# EasyEDA Pro project EasyEDA_ProPrj_Magnetic_Pole_Detector.epro

# Schematic SCH_Magnetic_Pole_Detector
Board Name: Magnetic_Pole_Detector; Create Date: 2026-03-04; Page Name: P1; Project Name: Magnetic_Pole_Detector; Schematic Name: SCH_Magnetic_Pole_Detector; Update Date: 2026-04-22; Drawn: nikzin96; Page Size: A4; Version: V1.0
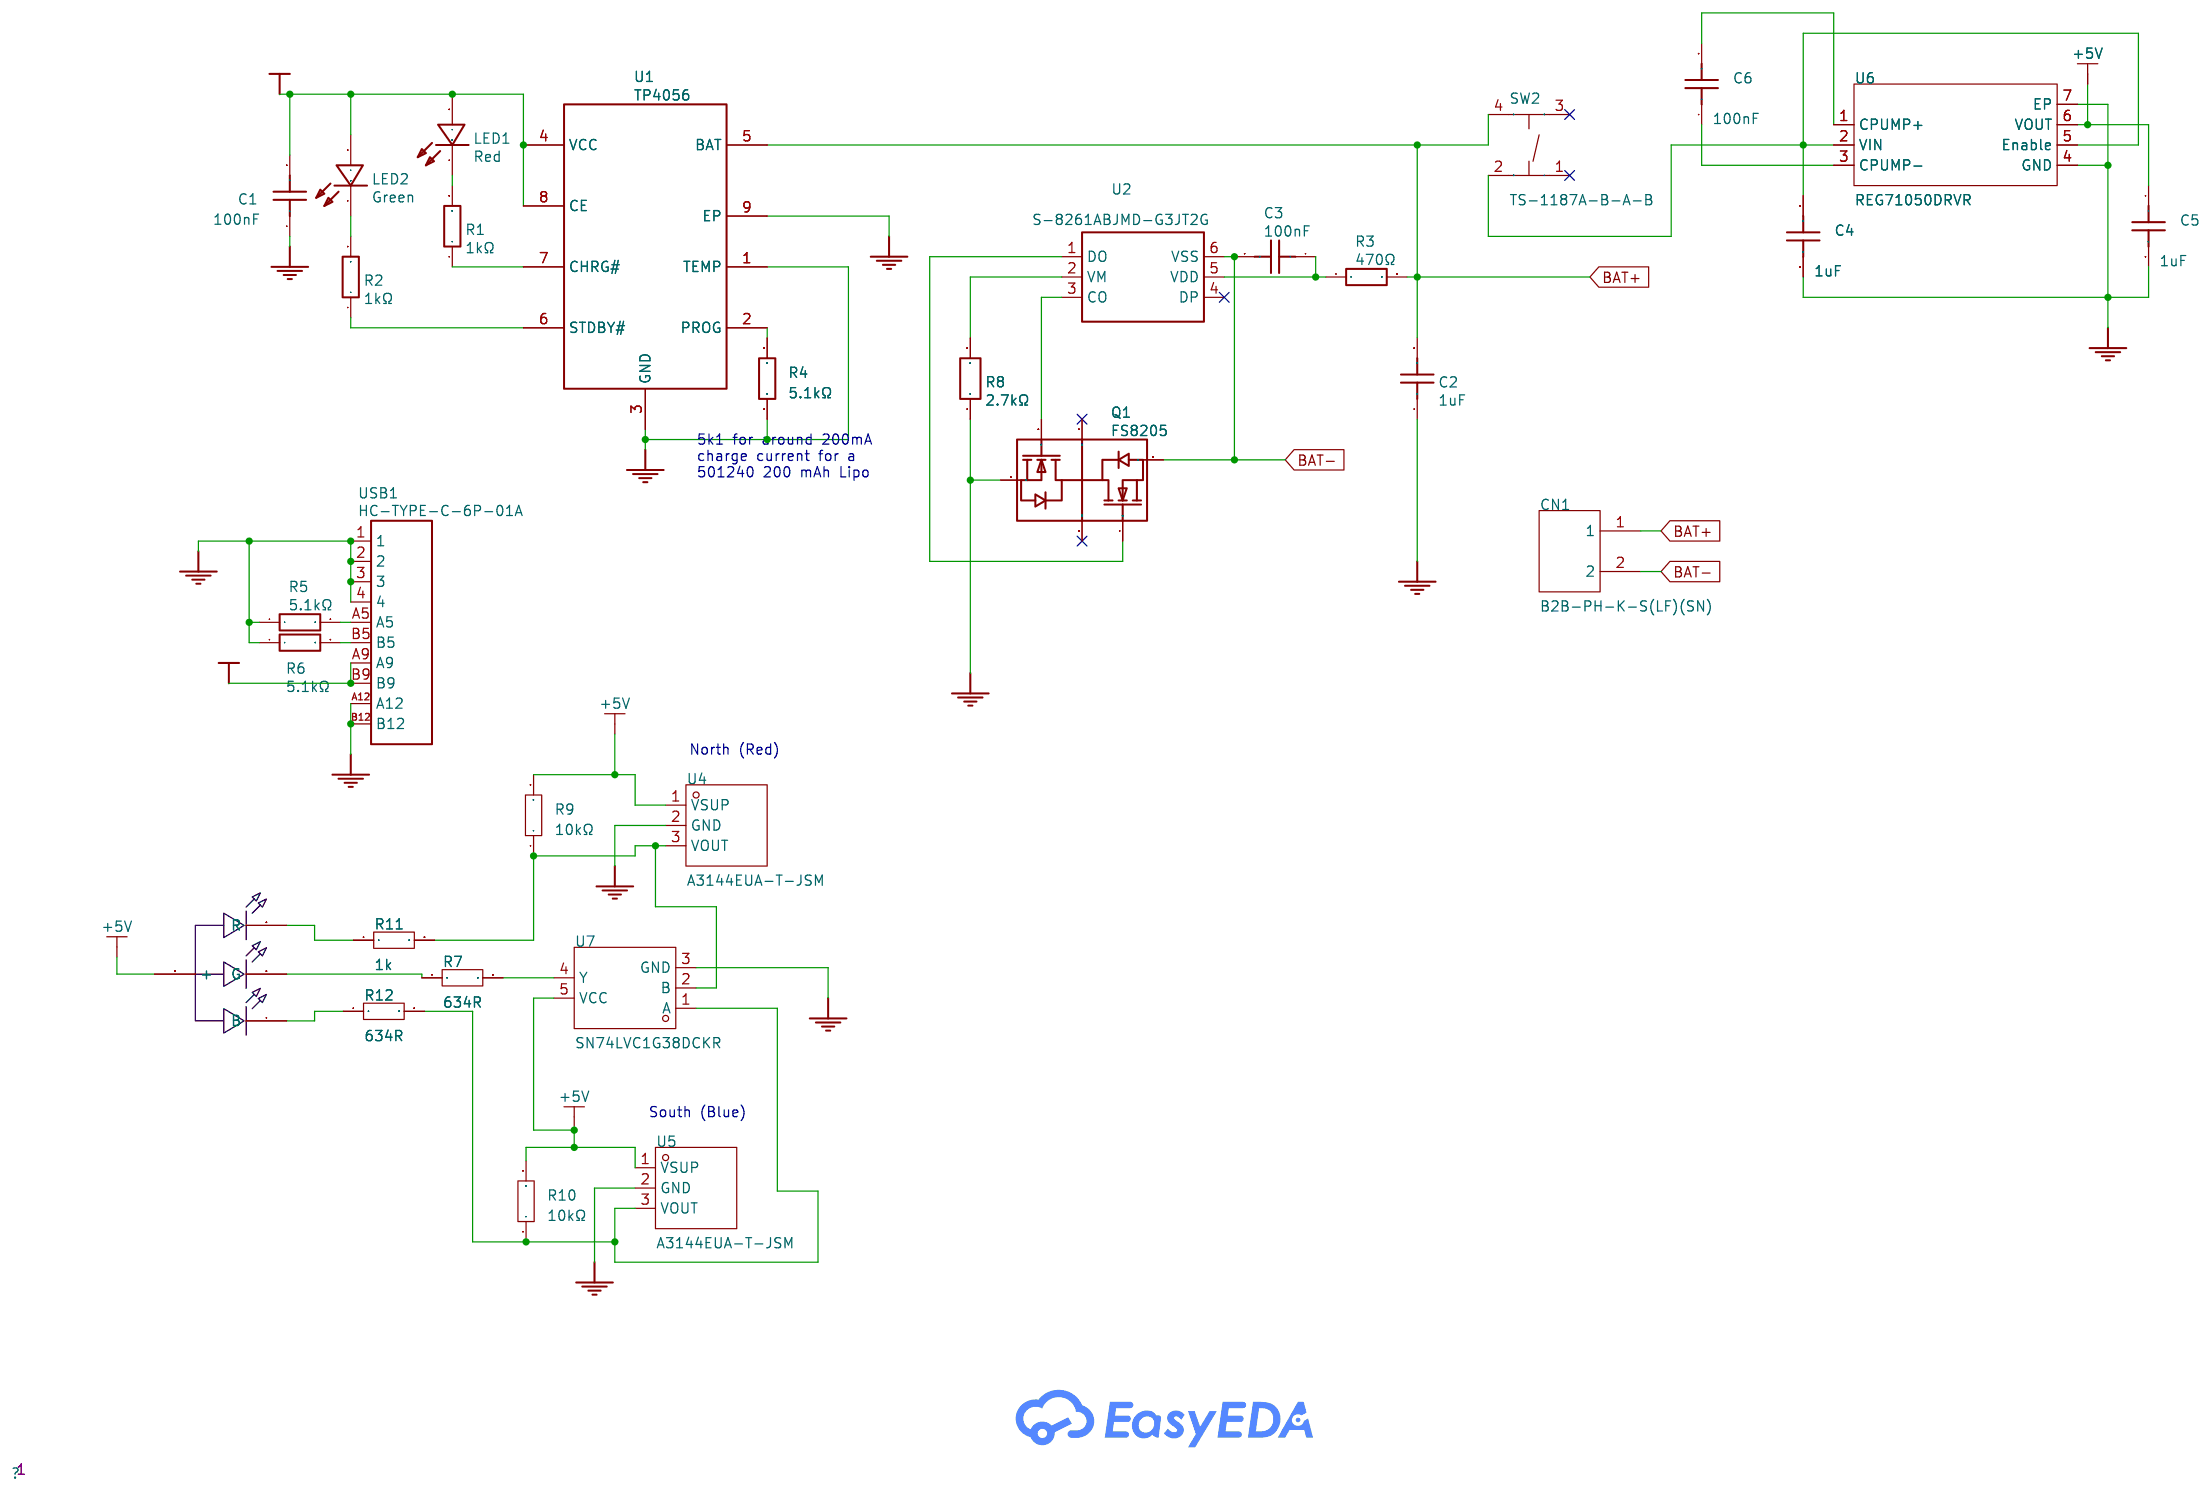
[diagram p0: schematic sheet]

## Parts
C1  100nF  [C0402]
C2  1uF  [C0402]
C3  100nF  [C0402]
C4  1uF  [C0402]
C5  1uF  [C0402]
C6  100nF  [C0402]
CN1  B2B-PH-K-S(LF)(SN)  [CONN-TH_B2B-PH-K-S]
LED1  Red  [LED0603-RD_RED]
LED2  Green  [LED0603-RD_RED]
LED3  LED 5mm RGB  [5MM RGB TRI-COLOR LED 1.25MM PINS]
Q1  FS8205  [SOT-23-6_L2.9-W1.6-P0.95-LS2.8-BR]
R1  1kΩ  [R0402]
R2  1kΩ  [R0402]
R3  470Ω  [R0402]
R4  5.1kΩ  [R0402]
R5  5.1kΩ  [R0402]
R6  5.1kΩ  [R0402]
R7  634R  [R0402]
R8  2.7kΩ  [R0402]
R9  10kΩ  [R0402]
R10  10kΩ  [R0402]
R11  1k  [R0402]
R12  634R  [R0402]
SW2  TS-1187A-B-A-B  [SW-SMD_4P-L5.1-W5.1-P3.70-LS6.5-TL_H1.5]
U1  TP4056  [ESOP-8_L4.9-W3.9-P1.27-LS6.0-BL-EP]
U2  S-8261ABJMD-G3JT2G  [SOT-23-6_L2.9-W1.6-P0.95-LS2.8-TL]
U4  A3144EUA-T-JSM  [TO-92S-3_L4.1-W1.7-P1.27-L]
U5  A3144EUA-T-JSM  [TO-92S-3_L4.1-W1.7-P1.27-L]
U6  REG71050DRVR  [WSON-6_L2.0-W2.0-P0.65-TL-EP]
U7  SN74LVC1G38DCKR  [SC-70-5_L2.1-W1.3-P0.65-LS2.1-BL]
USB1  HC-TYPE-C-6P-01A  [USB-C-SMD_HC-TYPE-C-6P-01A]

## Library data of the parts
C1 C3-C6 = 100nF: Supplier: LCSC; Manufacturer: YAGEO; Manufacturer Part: CC0402KRX7R7BB104; Supplier Part: C60474; JLCPCB Part Class: Extended Part; nameAlias: Capacitance; spicePre: C; spiceSymbolName: 0603F104Z500
C2 = 10uF: Supplier: LCSC; Manufacturer: FH(风华); Manufacturer Part: 0402X106M100NT; Supplier Part: C2846677; JLCPCB Part Class: Extended Part; nameAlias: Capacitance; spicePre: C; spiceSymbolName: 0603X106M100NT
CN1 = B2B-PH-K-S(LF)(SN): Pins Structure:1x2P Pitch:2mm Mounting Type:Through Hole Reference Series:PH Number of Pins:2P Number of Rows:1 Number of PINs Per Row:2 Row Spacing:- Current Rating:2A Contact Material:Brass Contact Plating:Tin Operating Temperature:-25℃~+85℃ Operating T; LCSC Part Name: 1x2P 间距:2mm 直插 系列:PH; Supplier Part: C131337; Manufacturer: JST; Supplier Footprint: 插件,P=2mm; JLCPCB Part Class: Extended Part; Datasheet: https://item.szlcsc.com/datasheet/B2B-PH-K-S(LF)(SN)/142630.html; Supplier: LCSC; Pins Structure: 1x2P; Pitch: 2mm; Mounting Type: Through Hole; Reference Series: PH; Number of Pins: 2P; Number of Rows: 1; Number of PINs Per Row: 2; Current Rating: 2A; Contact Material: Brass; Contact Plating: Tin; Operating Temperature: -25℃~+85℃; Voltage Rating: 100V; Plastic Material: PA66; Flame Retardant Rating: UL94V-0; Supplementary Features: K Pin; Color: White; Z-Height of the Board: 6mm; X-Length of Bottom Edge on Board (Spacing Line): 5.9mm; Y-Width of Bottom Edge on Board: 4.5mm
LED1 = Red: Supplier: LCSC; Supplier Part: C601667; Manufacturer: TOGIALED(统佳); Manufacturer Part: TJ-S1608SW6THBLC2R-A5; JLCPCB Part Class: Extended Part; Contributor: LCSC; spicePre: L; spiceSymbolName: TJ-S1608SW6THBLC2R-A5
LED2 = Green: Supplier: LCSC; Supplier Part: C192666; Manufacturer: TOGIALED(统佳); Manufacturer Part: TJ-S1608SW6TGLC7K-A5; JLCPCB Part Class: Extended Part; Contributor: LCSC; spicePre: L; spiceSymbolName: TJ-S1608SW6THBLC2R-A5
LED3 = RGB_LED_Common_Anode: Common Anode RGB LED for general purpose lighting
Q1 = FS8205: Supplier: LCSC; Manufacturer: FUXINSEMI(富芯森美); Manufacturer Part: FS8205A; Supplier Part: C908265; JLCPCB Part Class: Extended Part; spicePre: Q
R1 R2 = 1kΩ: Supplier: LCSC; Manufacturer: UNI-ROYAL(厚声); Manufacturer Part: 0402WGF1001TCE; Supplier Part: C11702; Resistance: 1K; JLCPCB Part Class: Extended Part; nameAlias: Resistance; spicePre: R; spiceSymbolName: 0603WAD1001T5E
R3 = 470Ω: Supplier: LCSC; Manufacturer: UNI-ROYAL(厚声); Manufacturer Part: 0402WGF4700TCE; Supplier Part: C25117; Resistance: 470; JLCPCB Part Class: Extended Part; nameAlias: Resistance; spicePre: R; spiceSymbolName: CR0603FA4700G
R4-R6 = 5.1kΩ: Supplier: LCSC; Manufacturer Part: 0402WGF5101TCE; Manufacturer: UNI-ROYAL(厚声); Supplier Part: C25905; Resistance: 5.1K; JLCPCB Part Class: Basic Part; nameAlias: Resistance; spicePre: R; spiceSymbolName: 0603WAF5101T5E
R7 R11 R12 = Res_0603: Supplier Footprint: 0603
R8 = 2.7kΩ: Supplier: LCSC; Supplier Part: C25885; Manufacturer: UNI-ROYAL(厚声); Manufacturer Part: 0402WGF2701TCE; Resistance: 2.7K; JLCPCB Part Class: Extended Part; nameAlias: Resistance; Contributor: LCSC; spicePre: R; spiceSymbolName: 0603WAD2701T5E
R9 = FCR0402F10K: Type:Thick Film Resistor Resistance:10kΩ Tolerance:±1% Tolerance:±1% Power(Watts):62.5mW Voltage-Supply(Max):50V Temperature Coefficient:±100ppm/℃ Temperature Coefficient:±100ppm/℃ Operating Temperature:-55℃~+155℃ Operating Temperature:-55℃~+155℃; LCSC Part Name: 厚膜电阻 10kΩ ±1% 62.5mW; Supplier Part: C5913148; Manufacturer: VO(翔胜); Supplier Footprint: 0402; JLCPCB Part Class: Extended Part; Datasheet: https://item.szlcsc.com/datasheet/FCR0402F10K/6849660.html; Supplier: LCSC; Type: Thick Film Resistor; Tolerance: ±1%; Power(Watts): 62.5mW; Voltage-Supply(Max): 50V; Temperature Coefficient: ±100ppm/℃; Operating Temperature: -55℃~+155℃
R10 = SCR0402F10K: Type:Thick Film Resistor Resistance:10kΩ Tolerance:±1% Tolerance:±1% Power(Watts):62.5mW Voltage-Supply(Max):50V Operating Temperature:-55℃~+155℃ Operating Temperature:-55℃~+155℃; LCSC Part Name: 厚膜电阻 10kΩ ±1% 62.5mW; Supplier Part: C3015825; Manufacturer: VO(翔胜); Supplier Footprint: 0402; JLCPCB Part Class: Extended Part; Datasheet: https://item.szlcsc.com/datasheet/SCR0402F10K/3528279.html; Supplier: LCSC; Type: Thick Film Resistor; Tolerance: ±1%; Power(Watts): 62.5mW; Voltage-Supply(Max): 50V; Operating Temperature: -55℃~+155℃
SW2 = TS-1187A-B-A-B: Circuit:SPST Actuator Style:Round Button Operating Force:1.6N Mounting Type:Surface Mount,Vertical Length:5.1mm Width:5.1mm Switch Height:1.5mm with Bracket:Without Bracket Contact Current:50mA Voltage Rating:12V Actuator/Cap Color:Gold With Lamp:No Life:; LCSC Part Name: 5.1*5.1*1.5mm 立贴 轻触开关; Supplier Part: C318884; Manufacturer: XKB Connection(中国星坤); Supplier Footprint: SMD; JLCPCB Part Class: Basic Part; Datasheet: https://item.szlcsc.com/datasheet/TS-1187A-B-A-B/299976.html; Supplier: LCSC; Circuit: SPST; Actuator Style: Round Button; Operating Force: 1.6N; Mounting Type: Surface Mount,Vertical; Length: 5.1mm; Width: 5.1mm; Switch Height: 1.5mm; with Bracket: Without Bracket; Contact Current: 50mA; Voltage Rating: 12V; Actuator/Cap Color: Gold; With Lamp: No; Life: 100,000 Cycles; Operating Temperature: -30℃~+85℃
U1 = TP4056: Supplier: LCSC; Manufacturer: UMW; Supplier Part: C725790; JLCPCB Part Class: Basic Part; Contributor: Guest; spicePre: U
U2 = S-8261ABJMD-G3JT2G: Supplier: LCSC; Manufacturer: ABLIC(艾普凌科); Manufacturer Part: S-8261ABJMD-G3JT2S; Supplier Part: C28081; JLCPCB Part Class: Extended Part; spicePre: U
U4 U5 = A3144EUA-T-JSM: Type:Unipolar Voltage - Supply:3.8V~40V Voltage - Supply:3.8V~40V Operation Points:6mT Operation Points:6mT Release Points:4mT Release Points:4mT Operating Temperature:-40℃~+125℃ Operating Temperature:-40℃~+125℃ Operating Current:6mA Output Type:Open Coll; LCSC Part Name: 耐高压高灵敏度单极霍尔开关; Supplier Part: C18188954; Manufacturer: JSMSEMI(杰盛微); Supplier Footprint: TO-92S; JLCPCB Part Class: Extended Part; Datasheet: https://item.szlcsc.com/datasheet/A3144EUA-T-JSM/19337998.html; Supplier: LCSC; Type: Unipolar; Voltage - Supply: 3.8V~40V; Operation Points: 6mT; Release Points: 4mT; Operating Temperature: -40℃~+125℃; Operating Current: 6mA; Output Type: Open Collector
U6 = REG71050DRVR: Operating Voltage:2.7V~5.5V Operating Voltage:2.7V~5.5V Quiescent Current:100uA Switching Frequency:1MHz Operating Temperature:-40℃~+85℃ Operating Temperature:-40℃~+85℃ Function:Buck-Boost Output Voltage:5V Output Voltage:5V PFM Mode:Not supported Output; LCSC Part Name: Buck-Boost电荷泵，输出电流高达60mA; Supplier Part: C2070744; Manufacturer: TI(德州仪器); Supplier Footprint: WSON-6-EP(2x2); JLCPCB Part Class: Extended Part; Datasheet: https://www.ti.com/cn/lit/gpn/reg71050; Supplier: LCSC; Operating Voltage: 2.7V~5.5V; Quiescent Current: 100uA; Switching Frequency: 1MHz; Operating Temperature: -40℃~+85℃; Function: Buck-Boost; Output Voltage: 5V; PFM Mode: Not supported; Output Current: 60mA
U7 = SN74LVC1G38DCKR: Logic Type:NAND Gate Number of Channels:1 Voltage - Supply:1.65V~5.5V Voltage - Supply:1.65V~5.5V Quiescent Current:10uA Current - Output Low(IOL):32mA Input Logic Level - High:- Input Logic Level - High:- Input Logic Level - Low:- Input Logic Level - Low; Supplier Part: C485079; Manufacturer: TI(德州仪器); Supplier Footprint: SC-70-5; JLCPCB Part Class: Extended Part; Datasheet: https://www.ti.com/cn/lit/gpn/sn74lvc1g38; Supplier: LCSC; Logic Type: NAND Gate; Number of Channels: 1; Voltage - Supply: 1.65V~5.5V; Quiescent Current: 10uA; Current - Output Low(IOL): 32mA; Series: 74LVC Series; Propagation Delay: 4.9ns@3.3V; Operating Temperature: -40℃~+125℃; Input Number: 2
USB1 = HC-TYPE-C-6P-01A: Supplier: LCSC; Supplier Part: C2894893; Manufacturer: HCTL(华灿天禄); JLCPCB Part Class: Extended Part; Contributor: LCSC; spicePre: U

## Nets
+5V: C5.1 LED3.1(+) R9.2 R10.2 U4.1(VSUP) U5.1(VSUP) U6.6(VOUT) U7.5(VCC)
GND: C1.1 C2.1 C4.2 C5.2 Q1.1(S1) R4.1 R5.1 R6.1 R8.1 U1.1(TEMP) U1.3(GND) U1.9(EP) U4.2(GND) U5.2(GND) U6.4(GND) U6.7(EP) U7.3(GND) USB1.1 USB1.2 USB1.3 USB1.4 USB1.A12 USB1.B12
VBUS: C1.2 LED1.2(A) LED2.2(A) U1.4(VCC) U1.8(CE) USB1.A9 USB1.B9
BAT+: C2.2 CN1.1 R3.2 SW2.4(D) U1.5(BAT)
BAT-: C3.2 CN1.2 Q1.3(S2) U2.6(VSS)
$1N824: R6.2 USB1.B5
$1N825: R5.2 USB1.A5
$1N830: R1.1 U1.7(CHRG#)
$1N831: LED1.1(C) R1.2
$1N832: R2.1 U1.6(STDBY#)
$1N833: LED2.1(C) R2.2
$1N2403: R9.1 R11.2 U4.3(VOUT) U7.2(B)
$1N2682: LED3.4(B) R12.1
$1N2687: LED3.2(R) R11.1
$1N3870: C6.1 U6.3(CPUMP-)
$1N3875: C6.2 U6.1(CPUMP+)
$1N7912: C4.1 SW2.2(B) U6.2(VIN) U6.5(Enable)
$1N8540: R10.1 R12.2 U5.3(VOUT) U7.1(A)
Net-(C3-1): C3.1 R3.1 U2.5(VDD)
Net-(LED3-3): LED3.3(G) R7.1
Net-(Q1-4): Q1.4(G2) U2.1(DO)
Net-(Q1-6): Q1.6(G1) U2.3(CO)
Net-(R4-2): R4.2 U1.2(PROG)
Net-(R7-2): R7.2 U7.4(Y)
Net-(R8-2): R8.2 U2.2(VM)

Not connected (* = marked no-connect by the designer): Q1 2(D12)* 5(D12)*; SW2 1(A)* 3(C)*; U2 4(DP)*

## Notes on the sheet
- 5k1 for around 200mA
  charge current for a
  501240 200 mAh Lipo
- North (Red)
- South (Blue)

# Board PCB_Magnetic_Pole_Detector
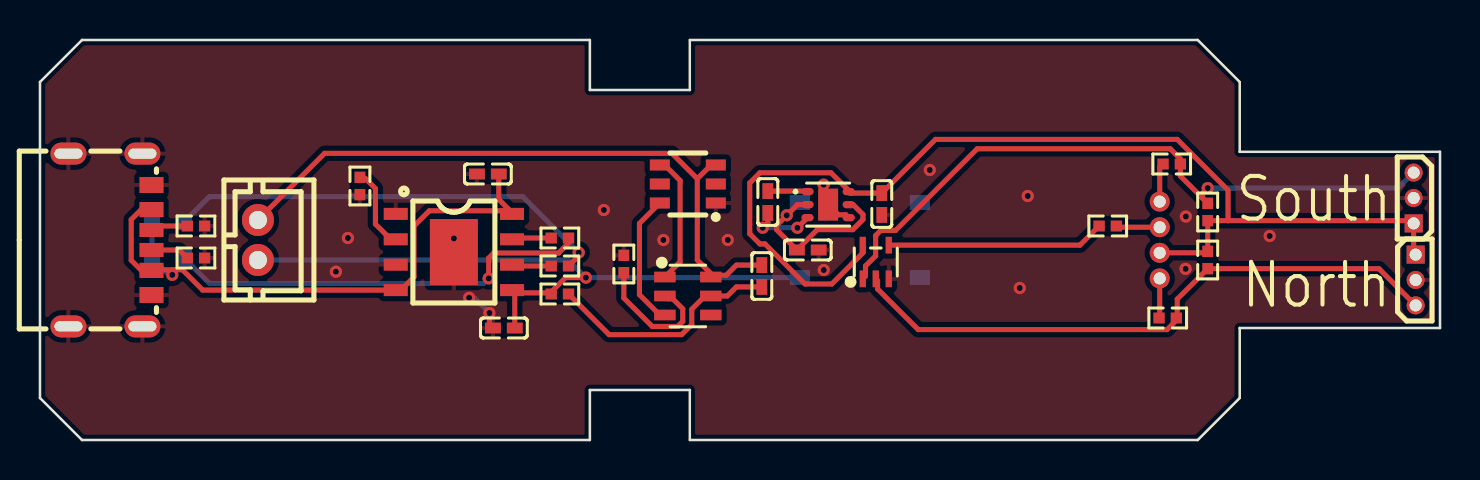
[diagram p1: board, top side]
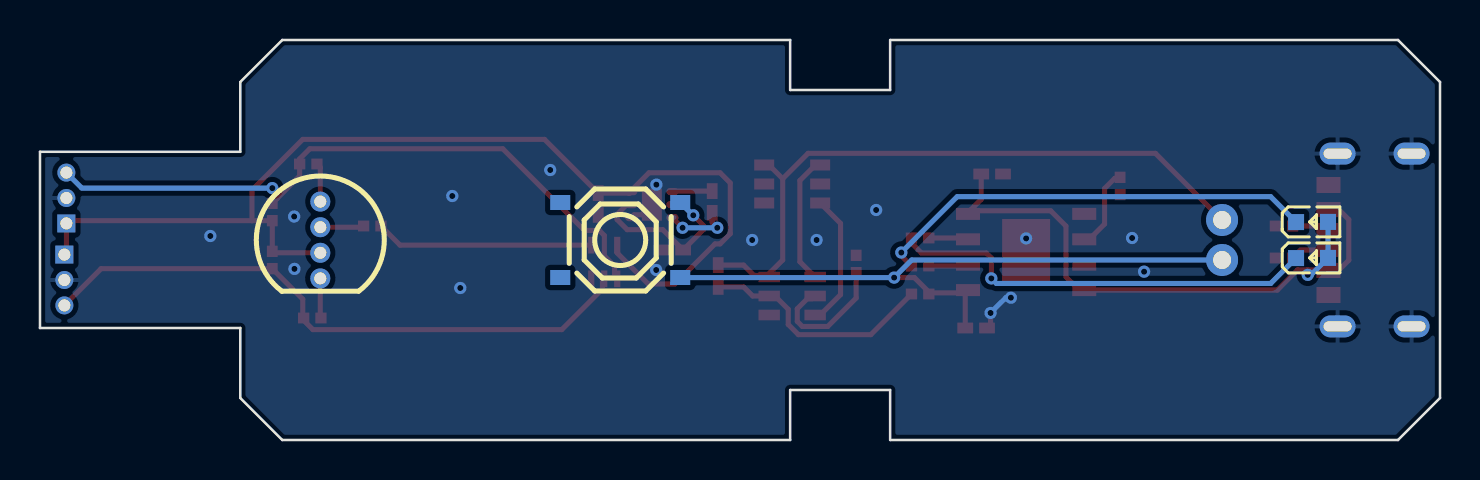
[diagram p2: board, bottom side, seen from below]

Outline 70.02 x 20 mm; copper layers: Top Layer, Bottom Layer. Coordinates in mm from the lower left corner of the outline.
Outline path: 0,17.9 2.1,20 27.5,20 27.5,17.5 32.5,17.5 32.5,20 57.9,20 60,17.9 60,14.41 70.02,14.41 70.02,5.6 60,5.6 60,2.1 57.9,0 32.5,0 32.5,2.5 27.5,2.5 27.5,0 2.1,0 0,2.1 0,17.9
Stack: Top Layer 0.035mm / Dielectric1 1.51mm FR4 er 4.5 / Bottom Layer 0.035mm

## Design rules (mm)
template: JLCPCB Capability(Two Layers Board)
spacing copperThickness1oz (default): track to track 0.102, other pairs 0.152 to 0.3
spacing copperThickness2oz: track to track 0.203, other pairs 0.152 to 0.3
track width copperThickness1oz (default): min 0.127, default 0.254, max 2.54
track width copperThickness2oz: min 0.203, default 0.254, max 2.54
differential pair differentialPair (default): width min 0.127, default 0.254, max 2.54; gap min 0.152, default 0.152
via viaSize (default): diameter min 0.5, default 0.61, max 10; hole min 0.3, default 0.305, max 6.3

## Placement (name value [footprint] x y rotation side)
C1  100nF  [C0402]  22.4 13.3 0 top
C2  1uF  [C0402]  23.2 5.6 0 top
C3  100nF  [C0402]  36.1 8.2 90 top
C4  1uF  [C0402]  38.4 9.5 0 top
C5  1uF  [C0402]  42.1 11.8 270 top
C6  100nF  [C0402]  36.4 11.9 90 top
CN1  B2B-PH-K-S(LF)(SN)  [CONN-TH_B2B-PH-K-S]  10.9 10 270 top
LED1  Red  [LED0603-RD_RED]  6.4 9.1 180 bottom
LED2  Green  [LED0603-RD_RED]  6.4 10.9 180 bottom
LED3  LED 5mm RGB  [5MM RGB TRI-COLOR LED 1.25MM PINS]  56 10 270 bottom
Q1  FS8205  [SOT-23-6_L2.9-W1.6-P0.95-LS2.8-BR]  32.4 12.8 0 top
R1  1kΩ  [R0402]  26 10.1 0 top
R2  1kΩ  [R0402]  26 8.7 0 top
R3  470Ω  [R0402]  26 7.3 180 top
R5  5.1kΩ  [R0402]  7.8 10.7 180 top
R6  5.1kΩ  [R0402]  7.8 9.1 180 top
R8  2.7kΩ  [R0402]  29.2 8.8 270 top
R9  10kΩ  [R0402]  58.4 9 90 top
R10  10kΩ  [R0402]  58.4 11.4 270 top
R11  1k  [R0402]  56.4 6.1 0 top
R12  634R  [R0402]  56.6 13.8 0 top
R13  5.1kΩ  [R0402]  16 12.7 90 top
R14  634R  [R0402]  53.4 10.7 180 top
SW2  TS-1187A-B-A-B  [SW-SMD_4P-L5.1-W5.1-P3.70-LS6.5-TL_H1.5]  41 10 180 bottom
U1  TP4056  [ESOP-8_L4.9-W3.9-P1.27-LS6.0-BL-EP]  20.7 9.4 270 top
U3  S-8261ABJMD-G3JT2G  [SOT-23-6_L2.9-W1.6-P0.95-LS2.8-TL]  32.4 7.2 0 top
U4  A3144EUA-T-JSM  [TO-92S-3_L4.1-W1.7-P1.27-L]  68.8 8 270 top
U5  A3144EUA-T-JSM  [TO-92S-3_L4.1-W1.7-P1.27-L]  68.7 12.1 90 top
U6  REG71050DRVR  [WSON-6_L2.0-W2.0-P0.65-TL-EP]  39.42 11.77 0 top
U7  SN74LVC1G38DCKR  [SC-70-5_L2.1-W1.3-P0.65-LS2.1-BL]  41.8 8.9 0 top
USB1  HC-TYPE-C-6P-01A  [USB-C-SMD_HC-TYPE-C-6P-01A]  3.5 10 270 top

## Footprints (pads in the part's own frame, mm; a bottom-side part is the same pattern mirrored in y, then rotated)
5MM RGB TRI-COLOR LED 1.25MM PINS
  round 1 hole 0.6: 1(0.64,0) 2(1.92,0) 3(-0.64,0) 4(-1.92,0)
C0402
  rect 0.79x0.54 smd: 1(-0.545,0) 2(0.545,0)
CONN-TH_B2B-PH-K-S
  round 1.6 hole 0.9: 1(1,0) 2(-1,0)
ESOP-8_L4.9-W3.9-P1.27-LS6.0-BL-EP
  rect 0.6x1.2 smd: 1(-1.905,-2.909) 2(-0.635,-2.909) 3(0.635,-2.909) 4(1.905,-2.909) 5(1.905,2.908) 6(0.635,2.908) 7(-0.635,2.908) 8(-1.905,2.908)
  rect 3.3x2.4 smd: 9(0,0)
LED0603-RD_RED
  rect 0.8x0.8 smd: 1(-0.799,-0.004) 2(0.799,0.004)
R0402
  rect 0.566x0.54 smd: 1(-0.433,0) 2(0.433,0)
SC-70-5_L2.1-W1.3-P0.65-LS2.1-BL
  rect 0.315x0.835 smd: 1(-0.65,-0.843) 2(0,-0.843) 3(0.65,-0.843) 4(0.65,0.843) 5(-0.65,0.843)
SOT-23-6_L2.9-W1.6-P0.95-LS2.8-BR
  rect 1x0.55 smd: 1(1.4,-0.95) 2(1.4,0) 3(1.4,0.95) 4(-1.4,0.95) 5(-1.4,0) 6(-1.4,-0.95)
SOT-23-6_L2.9-W1.6-P0.95-LS2.8-TL
  rect 1.072x0.532 smd: 1(-1.149,0.95) 2(-1.149,0) 3(-1.149,-0.95) 4(1.149,-0.95) 5(1.149,0) 6(1.149,0.95)
SW-SMD_4P-L5.1-W5.1-P3.70-LS6.5-TL_H1.5
  rect 1x0.75 smd: 1(-3,1.875) 2(3,1.875) 3(-3,-1.875) 4(3,-1.875)
TO-92S-3_L4.1-W1.7-P1.27-L
  rect 0.9x0.9 hole 0.6: 1(-1.27,0)
  round 0.9 hole 0.6: 2(0,0) 3(1.27,0)
USB-C-SMD_HC-TYPE-C-6P-01A
  oval 1.1x1.8 hole 0.5x1.401: 1(-4.32,1.623) 2(-4.32,-2.078) 3(4.32,1.623) 4(4.32,-2.078)
  rect 0.7x1.2 smd: A5(-0.5,2.078) B5(0.499,2.078)
  rect 0.76x1.2 smd: A9(1.52,2.078) B9(-1.52,2.078)
  rect 0.8x1.2 smd: A12(2.749,2.078) B12(-2.751,2.078)
WSON-6_L2.0-W2.0-P0.65-TL-EP
  oval 0.607x0.364 smd: 1(-1.028,0.65) 2(-1.028,0) 3(-1.028,-0.65) 4(1.028,-0.65) 5(1.028,0) 6(1.028,0.65)
  rect 1x1.6 smd: 7(0,0)

## Nets
+5V: C5.1 LED3.1 R9.2 R10.2 U4.1 U5.1 U6.6 U7.5
GND: C1.1 C2.1 C4.2 C5.2 Q1.1 R5.1 R6.1 R8.1 R13.1 U1.1 U1.3 U1.9 U4.2 U5.2 U6.4 U6.7 U7.3 USB1.1 USB1.2 USB1.3 USB1.4 USB1.A12 USB1.B12
VBUS: C1.2 LED1.2 LED2.2 U1.4 U1.8 USB1.A9 USB1.B9
BAT+: C2.2 CN1.1 R3.2 SW2.4 U1.5
BAT-: C3.2 CN1.2 Q1.3 U3.6
$1N824: R6.2 USB1.B5
$1N825: R5.2 USB1.A5
$1N830: R1.1 U1.7
$1N831: LED1.1 R1.2
$1N832: R2.1 U1.6
$1N833: LED2.1 R2.2
$1N834: R13.2 U1.2
$1N835: C3.1 R3.1 U3.5
$1N837: Q1.6 U3.3
$1N838: R8.2 U3.2
$1N839: Q1.4 U3.1
$1N2403: R9.1 R11.2 U4.3 U7.2
$1N2682: LED3.4 R12.1
$1N2687: LED3.2 R11.1
$1N3870: C6.1 U6.3
$1N3875: C6.2 U6.1
$1N7912: C4.1 SW2.2 U6.2 U6.5
$1N8435: LED3.3 R14.1
$1N8446: R14.2 U7.4
$1N8540: R10.1 R12.2 U5.3 U7.1

Pads without a net: Q1 2 5; SW2 1 3; U3 4

## Via types
v1: diameter 0.61, hole 0.305, Top Layer to Bottom Layer, 24 vias

## Routing (per net, layer and track width the routed paths; a pad name or vN(x,y) marks a point on that pad's centre or on a via; arc(x,y) is an arc through that point)
+5V: length 54.6
  Top Layer w0.254: 59.42,10.97 59.42,12.49 56.88,15.03 44.79,15.03 C5.1 40.58,12.34 ; 59.42,10.97 68.56,10.97 U5.1 68.7,9.37 U4.1 ; 59.42,10.97 R10.2 R9.2 58.33,9.36 LED3.1 ; 40.44,12.42 40.52,12.34 40.58,12.34 ; 40.58,12.34 39.56,13.36 36,13.36 35.5,12.85 35.5,10.31 36,9.81 36.26,9.81 38.26,7.8 39.6,7.8 41.15,9.35 U7.5
GND: length 3.5
  Top Layer w0.254: C2.1 22.48,5.78 v1(22.48,6.35) ; 40.44,11.12 40.3,11.26 39.92,11.26 U6.7
  Bottom Layer w0.254: v1(21.46,7.11) 21.72,7.11 v1(22.48,6.35)
  vias: v1(14.8,8.42) v1(15.4,10.1) v1(20.7,10.08) v1(28.2,11.5) v1(31.18,10) v1(34.4,10) v1(39.19,12.77) v1(39.2,8.5) v1(44.5,13.5) v1(49,7.6) v1(49.4,12.2) v1(57.31,11.17) v1(57.29,8.56) v1(61.5,10.2)
VBUS: length 31.6
  Top Layer w0.254: 23.45,11.46 U1.8 ; 23.45,11.46 23.45,11.52 22.94,12.03 C1.2 ; 23.45,11.46 19.47,11.46 18.71,10.7 18.71,8.16 18.05,7.5 U1.4 8.14,7.5 7.12,8.51 6.62,8.51 ; 6.62,8.51 5.61,8.51 USB1.A9 5.07,8.48 4.56,8.99 4.56,11.02 5.06,11.52 USB1.B9 ; 6.62,8.51 v1(6.62,8.26)
  Bottom Layer w0.254: LED2.2 LED1.2 6.45,8.26 v1(6.62,8.26)
BAT+: length 33.4
  Top Layer w0.254: 25.52,7.36 R3.2 ; 25.52,7.36 23.75,7.36 ; 25.52,7.36 26.28,8.12 v1(27.3,8.12) ; 23.75,7.36 U1.5 ; 23.75,7.36 C2.2
  Bottom Layer w0.254: 38,8.12 v1(27.3,8.12) 26.42,9 CN1.1
BAT-: length 33
  Top Layer w0.254: CN1.2 14.23,14.33 31.6,14.33 32.87,13.06 ; 32.87,13.06 33.56,13.75 Q1.3 ; 32.87,13.06 32.87,9 33.64,8.24 ; 33.64,8.24 U3.6 ; 33.64,8.24 34.32,8.24 34.83,8.75 C3.2
$1N824: length 2
  Top Layer w0.254: USB1.B5 6.97,9.5 7.37,9.1
$1N825: length 1.9
  Top Layer w0.254: USB1.A5 5.78,10.7 7.37,10.7
$1N830: length 2
  Top Layer w0.254: U1.7 23.67,10.1 R1.1
$1N831: length 21.4
  Top Layer w0.254: R1.2 26.43,9.85 25.94,9.35 22.69,9.35 22.44,9.1 v1(22.44,8.08)
  Bottom Layer w0.254: LED1.1 8.47,7.83 22.19,7.83 v1(22.44,8.08)
$1N832: length 2
  Top Layer w0.254: R2.1 23.67,8.7 U1.6
$1N833: length 22.3
  Top Layer w0.254: v1(26.94,9.37) 26.94,9.21 R2.2
  Bottom Layer w0.254: LED2.1 8.47,12.17 24.15,12.17 v1(26.94,9.37)
$1N834: length 4.1
  Top Layer w0.254: U1.2 17.54,10.03 16.78,10.8 16.78,12.58 16.27,13.08 16.05,13.08 16,13.13
$1N835: length 11.9
  Top Layer w0.254: C3.1 34.83,7.66 34.38,7.2 U3.5 33.26,7.2 32.6,6.54 32.6,5.78 32.09,5.27 28.47,5.27 R3.1
$1N837: length 6.7
  Top Layer w0.254: Q1.6 29.98,10.83 29.98,7.27 31,6.25 U3.3
$1N838: length 6.7
  Top Layer w0.254: U3.2 31.38,7.07 31.64,7.07 32.15,6.56 32.15,5.93 31.89,5.68 30.62,5.68 29.2,7.1 29.2,8.37
$1N839: length 6.5
  Top Layer w0.254: Q1.4 31.24,13.75 32.01,12.98 32.01,8.91 U3.1
$1N2403: length 31
  Top Layer w0.254: 56.88,6.14 56.88,6.03 56.37,5.52 43.92,5.52 41.89,7.55 41.89,7.97 U7.2 ; 56.88,6.14 56.88,7.04 R9.1 66.96,8.57 U4.3 ; 56.88,6.14 R11.2
$1N2682: length 1.9
  Top Layer w0.254: LED3.4 56,13.63 R12.1
$1N2687: length 2
  Top Layer w0.254: LED3.2 56,6.13 R11.1
$1N3870: length 3.3
  Top Layer w0.254: C6.1 36.4,10.86 v1(36.15,10.61) ; v1(37.88,10.61) U6.3
  Bottom Layer w0.254: v1(36.15,10.61) v1(37.88,10.61)
$1N3875: length 2
  Top Layer w0.254: 36.4,12.44 38.36,12.44 U6.1
$1N7912: length 9.6
  Top Layer w0.254: U6.2 37.88,11.77 v1(37.35,11.24) 36.84,10.73 36.84,10.52 C4.1 38.87,10.52 40.65,10.52 41.16,11.02 41.16,11.28 40.67,11.77 40.44,11.77
  Bottom Layer w0.254: v1(37.35,11.24) 37.36,11.24 SW2.2
$1N8435: length 2.2
  Top Layer w0.254: LED3.3 53.89,10.64 R14.1
$1N8446: length 10.9
  Top Layer w0.254: R14.2 52.01,9.74 U7.4
$1N8540: length 33.7
  Top Layer w0.254: 58.15,12.09 58.15,12.34 v1(58.4,12.59) ; 58.15,12.09 57.03,13.2 R12.2 57.03,14.05 56.53,14.56 46.87,14.56 42.79,10.48 42.05,10.48 41.79,10.22 41.79,9.21 41.28,8.7 41.28,8.19 U7.1 ; 58.15,12.09 58.4,11.83
  Bottom Layer w0.254: U5.3 67.93,12.59 v1(58.4,12.59)

## Copper pours and planes (outline as drawn; the poured copper is in the pictures)
GND on Top Layer: -5.8,26.9 77.3,26.9 77.3,-12.2 -5.8,-12.2
GND on Bottom Layer: -2.6,23.7 74.1,23.7 74.1,-6.6 -2.6,-6.6

## Text on the board
Top Silkscreen Layer: South | North
